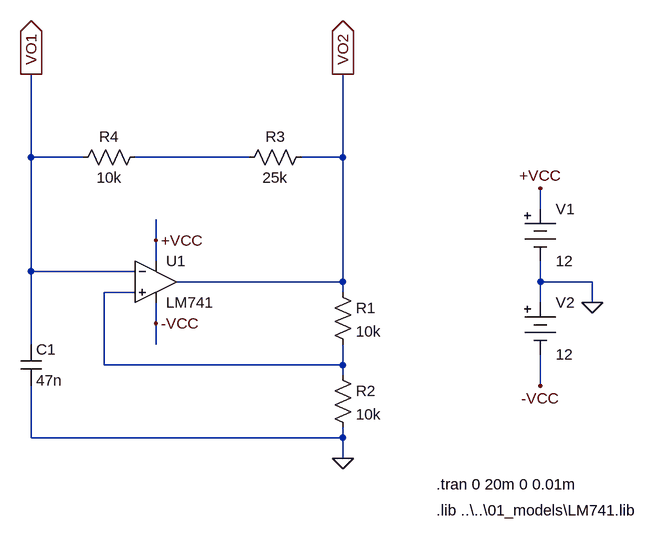
[diagram p0: schematic rcosc_03_04_01_vout.asc]
rcosc_03_04_01_vout.asc, the LTspice schematic file:
Version 4
SHEET 1 1008 680
WIRE 16 -112 16 -240
WIRE 96 -112 16 -112
WIRE 352 -112 176 -112
WIRE 496 -112 496 -240
WIRE 496 -112 432 -112
WIRE 800 -32 800 -64
WIRE 208 16 208 -16
WIRE 208 48 208 16
WIRE 16 64 16 -112
WIRE 176 64 16 64
WIRE 496 80 496 -112
WIRE 496 80 240 80
WIRE 800 80 800 48
WIRE 880 80 800 80
WIRE 176 96 128 96
WIRE 496 96 496 80
WIRE 800 112 800 80
WIRE 880 112 880 80
WIRE 208 144 208 112
WIRE 16 176 16 64
WIRE 208 176 208 144
WIRE 128 208 128 96
WIRE 496 208 496 176
WIRE 496 208 128 208
WIRE 496 224 496 208
WIRE 800 240 800 192
WIRE 16 320 16 240
WIRE 496 320 496 304
WIRE 496 320 16 320
WIRE 496 352 496 320
FLAG 880 112 0
FLAG 800 -64 +VCC
FLAG 800 240 -VCC
FLAG 208 16 +VCC
FLAG 208 144 -VCC
FLAG 496 352 0
FLAG 16 -240 VO1
IOPIN 16 -240 Out
FLAG 496 -240 VO2
IOPIN 496 -240 Out
SYMBOL Misc\\battery 800 -48 R0
WINDOW 123 0 0 Left 2
WINDOW 39 0 0 Left 2
SYMATTR InstName V1
SYMATTR Value 12
SYMBOL Misc\\battery 800 96 R0
WINDOW 123 0 0 Left 2
WINDOW 39 0 0 Left 2
SYMATTR InstName V2
SYMATTR Value 12
SYMBOL Opamps\\opamp2 208 16 R0
SYMATTR InstName U1
SYMATTR Value LM741
SYMBOL res 480 80 R0
SYMATTR InstName R1
SYMATTR Value 10k
SYMBOL res 480 208 R0
SYMATTR InstName R2
SYMATTR Value 10k
SYMBOL res 336 -96 R270
WINDOW 0 32 56 VTop 2
WINDOW 3 0 56 VBottom 2
SYMATTR InstName R3
SYMATTR Value 25k
SYMBOL res 80 -96 R270
WINDOW 0 32 56 VTop 2
WINDOW 3 0 56 VBottom 2
SYMATTR InstName R4
SYMATTR Value 10k
SYMBOL cap 0 176 R0
SYMATTR InstName C1
SYMATTR Value 47n
TEXT 640 432 Left 2 !.lib ..\\..\\01_models\\LM741.lib
TEXT 640 392 Left 2 !.tran 0 20m 0 0.01m

The netlist it stands for:
* rcosc_03_04_01_vout.asc
V1 +VCC 0 12
V2 0 -VCC 12
XU1 N002 VO1 +VCC -VCC VO2 LM741  ; pins In+ In- V+ V- OUT
R1 VO2 N002 10k
R2 N002 0 10k
R3 N001 VO2 25k
R4 VO1 N001 10k
C1 VO1 0 47n
.lib ..\..\01_models\LM741.lib
.tran 0 20m 0 0.01m
.backanno
.end